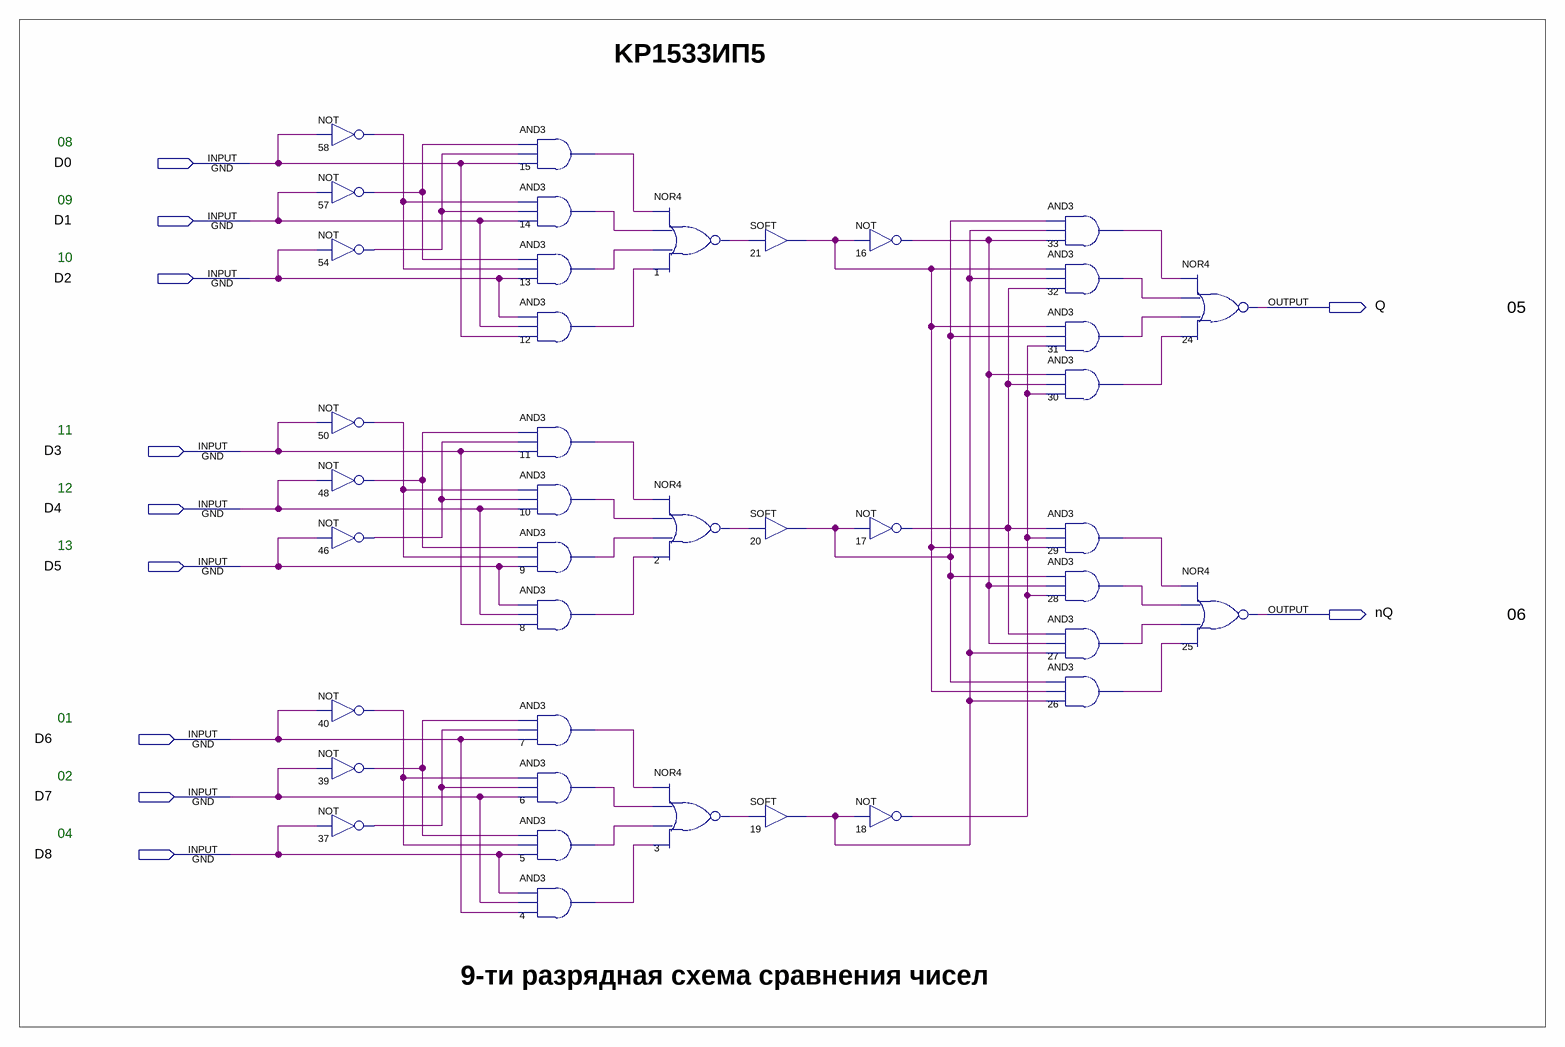
[diagram p0: schematic sheet]
// Quartus schematic KP1533IP5.bdf as structural Verilog: 40 symbols, 11 pins
module KP1533IP5 (
  input  D0,
  input  D1,
  input  D2,
  input  D3,
  input  D4,
  input  D5,
  input  D6,
  input  D7,
  input  D8,
  output Q,
  output nQ
);

  wire n1_out, n2_out, n3_out, n4_out, n5_out, n6_out, n7_out, n8_out, n9_out, n10_out, n11_out, n12_out,
       n13_out, n14_out, n15_out, n16_out, n17_out, n18_out, n19_out, n20_out, n21_out, n26_out, n27_out,
       n28_out, n29_out, n30_out, n31_out, n32_out, n33_out, n37_out, n39_out, n40_out, n46_out, n48_out,
       n50_out, n54_out, n57_out, n58_out;

  not u_58 (n58_out, D0);
  not u_57 (n57_out, D1);
  not u_54 (n54_out, D2);
  not u_50 (n50_out, D3);
  not u_48 (n48_out, D4);
  not u_46 (n46_out, D5);
  not u_40 (n40_out, D6);
  not u_39 (n39_out, D7);
  not u_37 (n37_out, D8);
  and u_15 (n15_out, n57_out, n54_out, D0);
  and u_14 (n14_out, n58_out, n54_out, D1);
  and u_13 (n13_out, n57_out, n58_out, D2);
  and u_12 (n12_out, D2, D1, D0);
  and u_11 (n11_out, n48_out, n46_out, D3);
  and u_10 (n10_out, n50_out, n46_out, D4);
  and u_9 (n9_out, n48_out, n50_out, D5);
  and u_8 (n8_out, D5, D4, D3);
  and u_7 (n7_out, n39_out, n37_out, D6);
  and u_6 (n6_out, n40_out, n37_out, D7);
  and u_5 (n5_out, n39_out, n40_out, D8);
  and u_4 (n4_out, D8, D7, D6);
  nor u_1 (n1_out, n15_out, n14_out, n13_out, n12_out);
  nor u_2 (n2_out, n11_out, n10_out, n9_out, n8_out);
  nor u_3 (n3_out, n7_out, n6_out, n5_out, n4_out);
  SOFT u_21 (.IN(n1_out), .OUT(n21_out));
  SOFT u_20 (.IN(n2_out), .OUT(n20_out));
  SOFT u_19 (.IN(n3_out), .OUT(n19_out));
  not u_16 (n16_out, n21_out);
  not u_17 (n17_out, n20_out);
  not u_18 (n18_out, n19_out);
  and u_33 (n33_out, n20_out, n19_out, n16_out);
  and u_32 (n32_out, n21_out, n19_out, n17_out);
  and u_31 (n31_out, n21_out, n20_out, n18_out);
  and u_30 (n30_out, n16_out, n17_out, n18_out);
  and u_29 (n29_out, n17_out, n18_out, n21_out);
  and u_28 (n28_out, n20_out, n16_out, n18_out);
  and u_27 (n27_out, n17_out, n16_out, n19_out);
  and u_26 (n26_out, n20_out, n21_out, n19_out);
  nor u_24 (Q, n33_out, n32_out, n31_out, n30_out);
  nor u_25 (nQ, n29_out, n28_out, n27_out, n26_out);

  // Notes on the sheet:
  //   KP1533ИП5
  //   08
  //   09
  //   10
  //   05
  //   11
  //   12
  //   13
  //   06
  //   01
  //   02
  //   04
  //   9-ти разрядная схема сравнения чисел
endmodule
